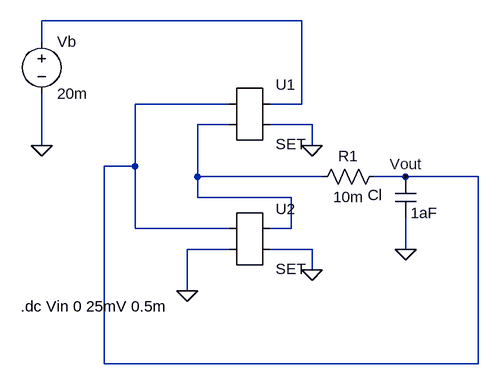
[diagram p0: schematic Draft6.asc]
Draft6.asc, the LTspice schematic file:
Version 4
SHEET 1 880 680
WIRE 320 -64 -80 -64
WIRE -80 -32 -80 -64
WIRE 208 64 64 64
WIRE 320 64 320 -64
WIRE 320 64 272 64
WIRE 208 96 160 96
WIRE 336 96 272 96
WIRE -80 128 -80 48
WIRE 336 128 336 96
WIRE 64 160 64 64
WIRE 64 160 16 160
WIRE 160 176 160 96
WIRE 352 176 160 176
WIRE 480 176 432 176
WIRE 592 176 480 176
WIRE 160 208 160 176
WIRE 304 208 160 208
WIRE 64 256 64 160
WIRE 208 256 64 256
WIRE 304 256 304 208
WIRE 304 256 272 256
WIRE 208 288 144 288
WIRE 336 288 272 288
WIRE 480 288 480 240
WIRE 336 320 336 288
WIRE 144 352 144 288
WIRE 16 464 16 160
WIRE 592 464 592 176
WIRE 592 464 16 464
FLAG 144 352 0
FLAG -80 128 0
FLAG 480 288 0
FLAG 480 176 Vout
FLAG 336 128 0
FLAG 336 320 0
SYMBOL AutoGenerated\\SET 240 80 R0
SYMATTR InstName U1
SYMBOL AutoGenerated\\SET 240 272 R0
SYMATTR InstName U2
SYMBOL voltage -80 -48 R0
SYMATTR InstName Vb
SYMATTR Value 20m
SYMBOL cap 464 176 R0
WINDOW 0 -42 28 Left 2
SYMATTR InstName Cl
SYMATTR Value 1aF
SYMBOL res 448 160 R90
WINDOW 0 0 56 VBottom 2
WINDOW 3 32 56 VTop 2
SYMATTR InstName R1
SYMATTR Value 10m
TEXT -112 376 Left 2 !.dc Vin 0 25mV 0.5m

The netlist it stands for:
* Draft6.asc
* U1: SET (symbol AutoGenerated\SET not available, pins judged from their places): pin1=Vout pin2=N002 pin3=N001 pin4=0
* U2: SET (symbol AutoGenerated\SET not available, pins judged from their places): pin1=Vout pin2=0 pin3=N002 pin4=0
Vb N001 0 20m
Cl Vout 0 1aF
R1 Vout N002 10m
.dc Vin 0 25mV 0.5m
.backanno
.end